# EAGLE design zb_pt4115_v1.2 (EAGLE 9.6.2)
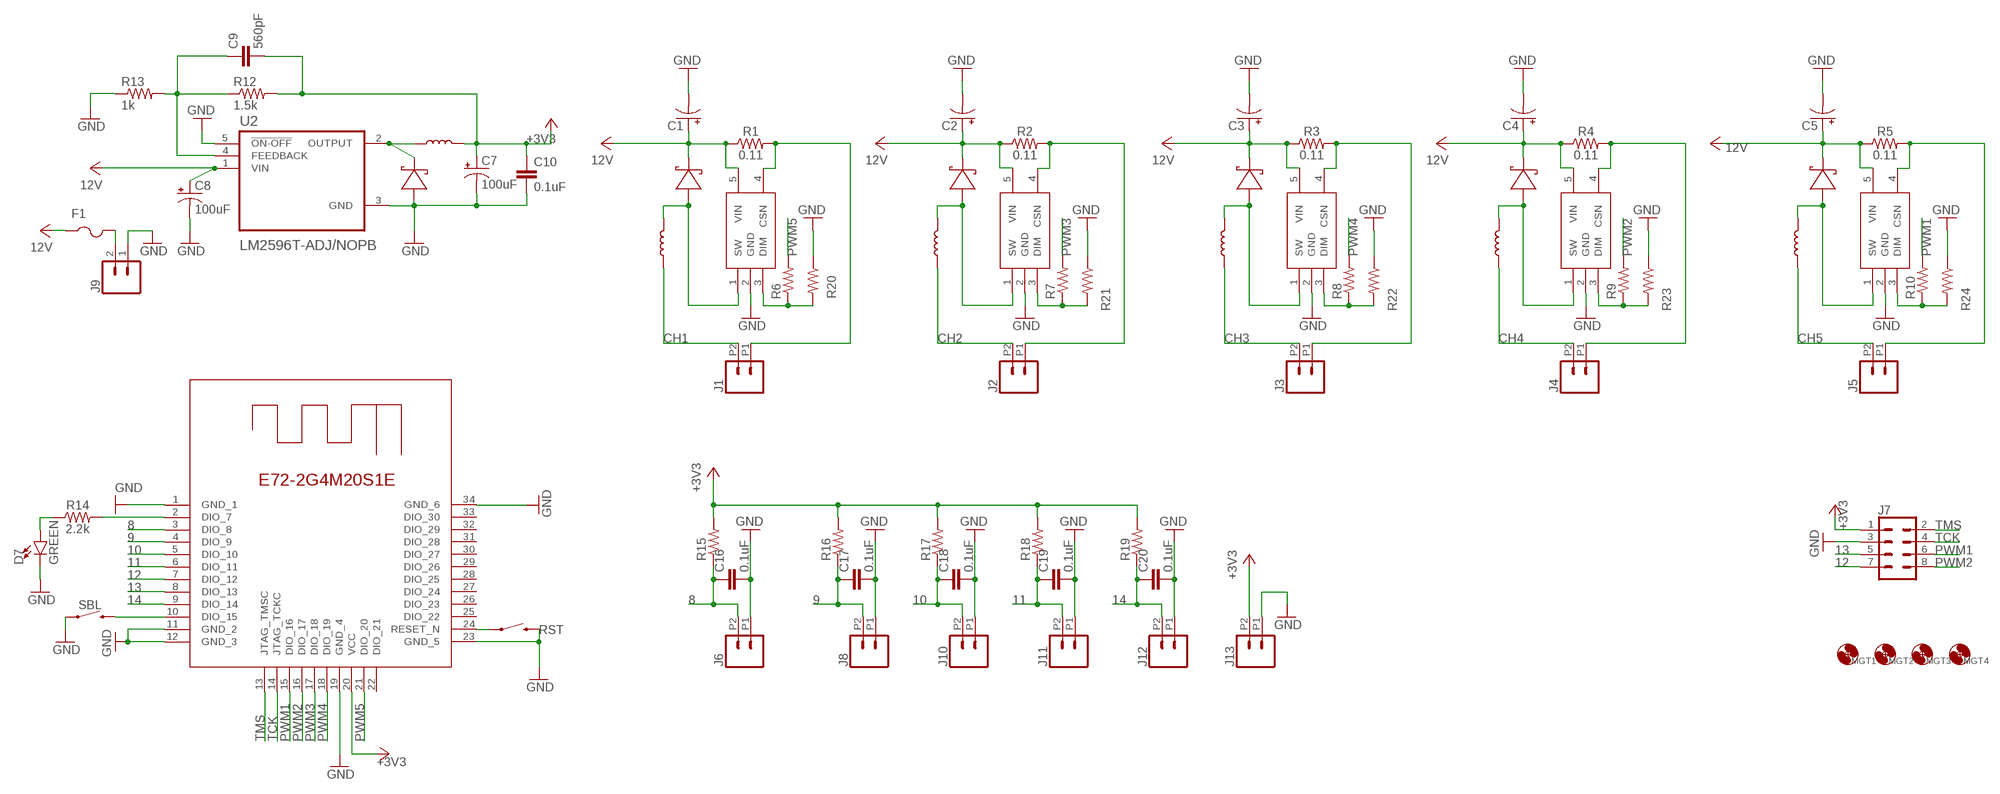
[diagram p0: schematic, sheet 1]

## Parts
C1  100uF  100UF-POLAR-EIA7343-16V-10%(TANT)  [EIA7343]
C2  100uF  100UF-POLAR-EIA7343-16V-10%(TANT)  [EIA7343]
C3  100uF  100UF-POLAR-EIA7343-16V-10%(TANT)  [EIA7343]
C4  100uF  100UF-POLAR-EIA7343-16V-10%(TANT)  [EIA7343]
C5  100uF  100UF-POLAR-EIA7343-16V-10%(TANT)  [EIA7343]
C7  100uF  100UF-POLAR-25V-20%(ELEC)  [PANASONIC_D]
C8  100uF  100UF-POLAR-25V-20%(ELEC)  [PANASONIC_D]
C9  560pF  560PF-0603-50V-5%  [0603]
C10  0.1uF  0.1UF-0603-25V-5%  [0603]
C16  0.1uF  0.1UF-0603-100V-10%  [0603]
C17  0.1uF  0.1UF-0603-100V-10%  [0603]
C18  0.1uF  0.1UF-0603-100V-10%  [0603]
C19  0.1uF  0.1UF-0603-100V-10%  [0603]
C20  0.1uF  0.1UF-0603-100V-10%  [0603]
D1  SS18  [DIOM5227X270N]
D2  SS18  [DIOM5227X270N]
D3  SS18  [DIOM5227X270N]
D4  SS18  [DIOM5227X270N]
D5  SS18  [DIOM5227X270N]
D6  SS18  [DIOM5227X270N]
D7  GREEN  LED-GREEN0603  [LED-0603]
F1  PTCFUSE-1812  [1812]
IC1  68uH  MSS1038-473MLB  [INDPM102100X400N]
IC2  68uH  MSS1038-473MLB  [INDPM102100X400N]
IC3  68uH  MSS1038-473MLB  [INDPM102100X400N]
IC4  68uH  MSS1038-473MLB  [INDPM102100X400N]
IC5  68uH  MSS1038-473MLB  [INDPM102100X400N]
IC6  68uH  MSS1038-473MLB  [INDPM102100X400N]
J1  CONN_022.54MM_SCREWTERM  [1X02_2.54_SCREWTERM]
J2  CONN_022.54MM_SCREWTERM  [1X02_2.54_SCREWTERM]
J3  CONN_022.54MM_SCREWTERM  [1X02_2.54_SCREWTERM]
J4  CONN_022.54MM_SCREWTERM  [1X02_2.54_SCREWTERM]
J5  CONN_022.54MM_SCREWTERM  [1X02_2.54_SCREWTERM]
J6  CONN_022.54MM_SCREWTERM  [1X02_2.54_SCREWTERM]
J7  CONN_04X2  [2X4]
J8  CONN_022.54MM_SCREWTERM  [1X02_2.54_SCREWTERM]
J9  CONN_025MM  [SCREWTERMINAL-5MM-2]
J10  CONN_022.54MM_SCREWTERM  [1X02_2.54_SCREWTERM]
J11  CONN_022.54MM_SCREWTERM  [1X02_2.54_SCREWTERM]
J12  CONN_022.54MM_SCREWTERM  [1X02_2.54_SCREWTERM]
J13  CONN_022.54MM_SCREWTERM  [1X02_2.54_SCREWTERM]
MGT1  MOUNT-HOLE3.0  [3,0]
MGT2  MOUNT-HOLE3.0  [3,0]
MGT3  MOUNT-HOLE3.0  [3,0]
MGT4  MOUNT-HOLE3.0  [3,0]
R1  0.11  0.11OHM-2010-1/2W-1%  [2010]
R2  0.11  0.11OHM-2010-1/2W-1%  [2010]
R3  0.11  0.11OHM-2010-1/2W-1%  [2010]
R4  0.11  0.11OHM-2010-1/2W-1%  [2010]
R5  0.11  0.11OHM-2010-1/2W-1%  [2010]
R6  100Ohm  R-US_R0805  [R0805]
R7  100Ohm  R-US_R0805  [R0805]
R8  100Ohm  R-US_R0805  [R0805]
R9  100Ohm  R-US_R0805  [R0805]
R10  100Ohm  R-US_R0805  [R0805]
R12  1.5k  R-US_R0805  [R0805]
R13  1k  R-US_R0805  [R0805]
R14  2.2k  2.2KOHM-0603-1/10W-1%  [0603]
R15  10k  R-US_R0805  [R0805]
R16  10k  R-US_R0805  [R0805]
R17  10k  R-US_R0805  [R0805]
R18  10k  R-US_R0805  [R0805]
R19  10k  R-US_R0805  [R0805]
R20  3k  R-US_R0805  [R0805]
R21  3k  R-US_R0805  [R0805]
R22  3k  R-US_R0805  [R0805]
R23  3k  R-US_R0805  [R0805]
R24  3k  R-US_R0805  [R0805]
RST  MOMENTARY-SWITCH-SPST-SMD-4.6X2.8MM  [TACTILE_SWITCH_SMD_4.6X2.8MM]
SBL  MOMENTARY-SWITCH-SPST-SMD-4.6X2.8MM  [TACTILE_SWITCH_SMD_4.6X2.8MM]
U2  LM2596T-ADJ/NOPB  [TO170P1016X470X2092-5]
U$1  PT4115  [SOT-89-5]
U$2  PT4115  [SOT-89-5]
U$3  PT4115  [SOT-89-5]
U$4  PT4115  [SOT-89-5]
U$5  PT4115  [SOT-89-5]
U$6  E72-2G4M20S1E  [E72-2G4M20S1E]

## Nets
8: C16.1 J6.P2 R15.1 U$6.3(DIO_8)
9: C17.1 J8.P2 R16.1 U$6.4(DIO_9)
10: C18.1 J10.P2 R17.1 U$6.5(DIO_10)
11: C19.1 J11.P2 R18.1 U$6.6(DIO_11)
12: J7.7 U$6.7(DIO_12)
13: J7.5 U$6.8(DIO_13)
14: C20.1 J12.P2 R19.1 U$6.9(DIO_14)
+3V3: C7.+ C9.2 C10.1 IC6.2 J7.1 J13.P2 R12.2 R15.2 R16.2 R17.2 R18.2 R19.2 U$6.20(VCC)
CH1: IC1.1 J1.P2
CH2: IC2.1 J2.P2
CH3: IC3.1 J3.P2
CH4: IC4.1 J4.P2
CH5: IC5.1 J5.P2
GND: C1.C(-) C2.C(-) C3.C(-) C4.C(-) C5.C(-) C7.- C8.- C10.2 C16.2 C17.2 C18.2 C19.2 C20.2 D6.2(A) D7.C J6.P1 J7.3 J8.P1 J9.1 J10.P1 J11.P1 J12.P1 J13.P1 R13.1 R20.1 R21.1 R22.1 R23.1 R24.1 RST.3 RST.4 SBL.1 SBL.2 U2.3(GND) U2.5(!ON-OFF) U$1.2(GND) U$2.2(GND) U$3.2(GND) U$4.2(GND) U$5.2(GND) U$6.1(GND_1) U$6.11(GND_2) U$6.12(GND_3) U$6.19(GND_4) U$6.23(GND_5) U$6.34(GND_6)
N$1: D1.2(A) IC1.2 U$1.1(SW)
N$2: R6.1 R20.2 U$1.3(DIM)
N$3: C9.1 R12.1 R13.2 U2.4(FEEDBACK)
N$4: D2.2(A) IC2.2 U$2.1(SW)
N$5: J1.P1 R1.2 U$1.4(CSN)
N$6: J2.P1 R2.2 U$2.4(CSN)
N$7: R7.1 R21.2 U$2.3(DIM)
N$8: R8.1 R22.2 U$3.3(DIM)
N$9: D3.2(A) IC3.2 U$3.1(SW)
N$10: J3.P1 R3.2 U$3.4(CSN)
N$11: R9.1 R23.2 U$4.3(DIM)
N$12: R10.1 R24.2 U$5.3(DIM)
N$13: D4.2(A) IC4.2 U$4.1(SW)
N$14: J4.P1 R4.2 U$4.4(CSN)
N$15: D7.A R14.1
N$16: D6.1(K) IC6.1 U2.2(OUTPUT)
N$17: D5.2(A) IC5.2 U$5.1(SW)
N$18: J5.P1 R5.2 U$5.4(CSN)
N$19: RST.1 RST.2 U$6.24(RESET_N)
N$20: R14.2 U$6.2(DIO_7)
N$28: SBL.3 SBL.4 U$6.10(DIO_15)
PWM1: J7.6 R10.2 U$6.15(DIO_16)
PWM2: J7.8 R9.2 U$6.16(DIO_17)
PWM3: R7.2 U$6.17(DIO_18)
PWM4: R8.2 U$6.18(DIO_19)
PWM5: R6.2 U$6.21(DIO_20)
TCK: J7.4 U$6.14(JTAG_TCKC)
TMS: J7.2 U$6.13(JTAG_TMSC)
VCC: C1.A(+) C2.A(+) C3.A(+) C4.A(+) C5.A(+) C8.+ D1.1(K) D2.1(K) D3.1(K) D4.1(K) D5.1(K) F1.1 F1.2 J9.2 R1.1 R2.1 R3.1 R4.1 R5.1 U2.1(VIN) U$1.5(VIN) U$2.5(VIN) U$3.5(VIN) U$4.5(VIN) U$5.5(VIN) ; supply symbol labelled 12V
Unconnected: U$6.22(DIO_21) U$6.25(DIO_22) U$6.26(DIO_23) U$6.27(DIO_24) U$6.28(DIO_25) U$6.29(DIO_26) U$6.30(DIO_27) U$6.31(DIO_28) U$6.32(DIO_29) U$6.33(DIO_30)

## Library data of the parts
C1-C5 = SparkFun-Capacitors:100UF-POLAR: 100µF polarized capacitors A capacitor is a passive two-terminal electrical component used to store electrical energy temporarily in an electric field.; PROD_ID: CAP-08702
C7 C8 = SparkFun-Capacitors:100UF-POLAR: 100µF polarized capacitors A capacitor is a passive two-terminal electrical component used to store electrical energy temporarily in an electric field.; PROD_ID: CAP-12547
C9 = SparkFun-Capacitors:560PF: 0.56nF/560pF ceramic capacitors A capacitor is a passive two-terminal electrical component used to store electrical energy temporarily in an electric field.; PROD_ID: CAP-08749
C10 = SparkFun-Capacitors:0.1UF: 0.1µF ceramic capacitors A capacitor is a passive two-terminal electrical component used to store electrical energy temporarily in an electric field.; PROD_ID: CAP-08604
C16-C20 = SparkFun-Capacitors:0.1UF: 0.1µF ceramic capacitors A capacitor is a passive two-terminal electrical component used to store electrical energy temporarily in an electric field.; PROD_ID: CAP-08390
D1-D6 = SS18:SS18: Schottky Diodes & Rectifiers 1a 80V Rectifier Schottky Barrier Source: Datasheet <https://componentsearchengine.com/Datasheets/2/SS18.pdf>; ARROW_PART_NUMBER: SS18; ARROW_PRICE-STOCK: https://www.arrow.com/en/products/ss18/on-semiconductor?region=nac; DESCRIPTION: Schottky Diodes & Rectifiers 1a 80V Rectifier Schottky Barrier; HEIGHT: 2.7mm; MANUFACTURER_NAME: ON Semiconductor; MANUFACTURER_PART_NUMBER: SS18; MOUSER_PART_NUMBER: 512-SS18; MOUSER_PRICE-STOCK: https://www.mouser.co.uk/ProductDetail/ON-Semiconductor-Fairchild/SS18?qs=mVVXn4M53U%252B25aMJheuSLA%3D%3D
D7 = SparkFun-LED:LED-GREEN: Green SMD LED Used in manufacturing of various products at SparkFun Packages: 0603 - SMD 0603 package [Product Link] <http://www.futureelectronics.com/en/technologies/semiconductors/optoelectronics/leds/Pages/9894312-LTST-C190GKT.aspx?CrossPart=HSMG-C190&IM=0> LilyPad 1206 - SMD1206 LilyPad package [Product Link] <http://www.futureelectronics.com/en/Technologies/Product.aspx?ProductID=IN150NGHARVATEKCORPORATION2049943&IM=0> 1206 - SMD1206 package [Product Link] <http://www.futureelectronics.com/en/technologies/semiconductors/optoelectronics/leds/Pages/8315665-LTST-C150KGKT.aspx?IM=0> 1206 Bottom Mount -SMD 1206 Bottom Mount [Product Link] <http://www.digikey.com/product-detail/en/lite-on-inc/LTST-C230KGKT/160-1456-1-ND/386854> SparkFun Products: Pro Mini 328 -5V <https://www.sparkfun.com/products/821> RedBoard <https://www.sparkfun.com/products/12757> MP3 Trigger <https://www.sparkfun.com/products/13720> Makey Makey <https://www.sparkfun.com/products/11076>; PROD_ID: DIO-00821
F1 = adafruit:PTCFUSE: PTC fuses, resettable thermistors
IC1-IC6 = MSS1038-473MLB:MSS1038-473MLB: Fixed Inductors MSS1038 SMT Shielded 47 uH 20 % 2.2 A Source: Datasheet <https://componentsearchengine.com/Datasheets/1/MSS1038-473MLB.pdf>; DESCRIPTION: Fixed Inductors MSS1038 SMT Shielded 47 uH 20 % 2.2 A; HEIGHT: 4mm; MANUFACTURER_NAME: COILCRAFT; MANUFACTURER_PART_NUMBER: MSS1038-473MLB; MOUSER_PART_NUMBER: 994-MSS1038-473MLB; MOUSER_PRICE-STOCK: https://www.mouser.co.uk/ProductDetail/Coilcraft/MSS1038-473MLB/?qs=VJjuEbE9QBN6EsaT8NREzg%3D%3D
J1-J6 J8 J10-J13 = SparkFun-Connectors:CONN_02: Multi connection point. Often used as Generic Header-pin footprint for 0.1 inch spaced/style header connections On any of the 0.1 inch spaced packages, you can populate with these: Break Away Headers - Straight <https://www.sparkfun.com/products/116> (PRT-00116) Break Away Male Headers - Right Angle <https://www.sparkfun.com/products/553> (PRT-00553) Female Headers <https://www.sparkfun.com/products/115> (PRT-00115) Break Away Headers - Machine Pin <https://www.sparkfun.com/products/117> (PRT-00117) Break Away Female Headers - Swiss Machine Pin <https://www.sparkfun.com/products/743> (PRT-00743) For SCREWTERMINALS and SPRING TERMINALS visit here: Screw Terimnals on SparkFun.com <https://www.sparkfun.com/search/results?term=Screw+Terminals> (5mm/3.5mm/2.54mm spacing) This device is also useful as a general connection point to wire up your design to another part of your project. Our various solder wires solder well into these plated through hole pads. Hook-Up Wire - Assortment (Stranded, 22 AWG) <https://www.sparkfun.com/products/11375> (PRT-11375) Hook-Up Wire - Assortment (Solid Core, 22 AWG) <https://www.sparkfun.com/products/11367> (PRT-11367) View the entire wire category on our website here <https://www.sparkfun.com/categories/141> Special notes: Molex polarized connector foot print use with: PRT-08233 with associated crimp pins and housings. 2.54_SCREWTERM for use with PRT-10571. 3.5mm Screw Terminal footprints for PRT-08084 5mm Screw Terminal footprints for use with PRT-08432
J7 = SparkFun-SEWPAD16:CONN_04X2: Multi connection point. Often used as Generic Header-pin footprint for 0.1 inch spaced/style header connections On any of the 0.1 inch spaced packages, you can populate with these: Break Away Headers - Straight <https://www.sparkfun.com/products/116> (PRT-00116) Break Away Male Headers - Right Angle <https://www.sparkfun.com/products/553> (PRT-00553) Female Headers <https://www.sparkfun.com/products/115> (PRT-00115) Break Away Headers - Machine Pin <https://www.sparkfun.com/products/117> (PRT-00117) Break Away Female Headers - Swiss Machine Pin <https://www.sparkfun.com/products/743> (PRT-00743)
J9 = SparkFun-SEWPAD16:CONN_02: Multi connection point. Often used as Generic Header-pin footprint for 0.1 inch spaced/style header connections On any of the 0.1 inch spaced packages, you can populate with these: Break Away Headers - Straight <https://www.sparkfun.com/products/116> (PRT-00116) Break Away Male Headers - Right Angle <https://www.sparkfun.com/products/553> (PRT-00553) Female Headers <https://www.sparkfun.com/products/115> (PRT-00115) Break Away Headers - Machine Pin <https://www.sparkfun.com/products/117> (PRT-00117) Break Away Female Headers - Swiss Machine Pin <https://www.sparkfun.com/products/743> (PRT-00743) For SCREWTERMINALS and SPRING TERMINALS visit here: Screw Terimnals on SparkFun.com <https://www.sparkfun.com/search/results?term=Screw+Terminals> (5mm/3.5mm/2.54mm spacing) This device is also useful as a general connection point to wire up your design to another part of your project. Our various solder wires solder well into these plated through hole pads. Hook-Up Wire - Assortment (Stranded, 22 AWG) <https://www.sparkfun.com/products/11375> (PRT-11375) Hook-Up Wire - Assortment (Solid Core, 22 AWG) <https://www.sparkfun.com/products/11367> (PRT-11367) View the entire wire category on our website here <https://www.sparkfun.com/categories/141> Special notes: Molex polarized connector foot print use with: PRT-08233 with associated crimp pins and housings. 2.54_SCREWTERM for use with PRT-10571. 3.5mm Screw Terminal footprints for PRT-08084 5mm Screw Terminal footprints for use with PRT-08432; SF_SKU: PRT-08432
MGT1-MGT4 = holes:MOUNT-HOLE: MOUNTING HOLE with drill center marker
R1-R5 = SparkFun-Resistors:0.11OHM: 0.11Ω resistor A resistor is a passive two-terminal electrical component that implements electrical resistance as a circuit element. Resistors act to reduce current flow, and, at the same time, act to lower voltage levels within circuits. - Wikipedia; PROD_ID: RES-08354
R6-R10 R12 R13 R15-R24 = adafruit:R-US_: RESISTOR, American symbol
R14 = SparkFun-Resistors:2.2KOHM: 2.2kΩ resistor A resistor is a passive two-terminal electrical component that implements electrical resistance as a circuit element. Resistors act to reduce current flow, and, at the same time, act to lower voltage levels within circuits. - Wikipedia; PROD_ID: RES-08272
RST SBL = SparkFun-Switches:MOMENTARY-SWITCH-SPST: Momentary Switch (Pushbutton) - SPST Normally-open (NO) SPST momentary switches (buttons, pushbuttons). Variants PTH-12MM - 12mm square, through-hole Momentary Pushbutton Switch - 12mm Square <https://www.sparkfun.com/products/9190> (COM-09190) PTH-6.0MM, PTH-6.0MM-KIT - 6.0mm square, through-hole Mini Pushbutton Switch <https://www.sparkfun.com/products/97> (COM-00097) KIT package intended for soldering kit's - only one side of pads' copper is exposed. PTH-RIGHT-ANGLE-KIT - Right-angle, through-hole Right Angle Tactile Button <https://www.sparkfun.com/products/10791> - Used on SparkFun BigTime Watch Kit <https://www.sparkfun.com/products/11734> SMD-12MM - 12mm square, surface-mount Tactile Button - SMD (12mm) <https://www.sparkfun.com/products/12993> (COM-12993) Used on SparkFun PicoBoard <https://www.sparkfun.com/products/11888> SMD-4.5MM - 4.5mm Square Trackball Switch Used on SparkFun Blackberry Trackballer Breakout <https://www.sparkfun.com/products/13169> SMD-4.6MMX2.8MM - 4.60mm x 2.80mm, surface mount Used on SparkFun SAMD21 Mini Breakout <https://www.sparkfun.com/products/13664> SMD-5.2MM, SMD-5.2-REDUNDANT - 5.2mm square, surface-mount Mini Pushbutton Switch - SMD <https://www.sparkfun.com/products/8720> (COM-08720) Used on Arduino Pro Mini <https://www.sparkfun.com/products/11114> REDUNDANT package connects both switch circuits together SMD-6.0X3.5MM - 6.0 x 3.5mm, surface mount Momentary Reset Switch SMD <https://www.sparkfun.com/products/8229> (COM-08229) SMD-6.2MM-TALL - 6.2mm square, surface mount Tactile Button - SMD (6mm) <https://www.sparkfun.com/products/12992> Used on SparkFun Digital Sandbox <https://www.sparkfun.com/products/12651> SMD-RIGHT-ANGLE - Right-angle, surface mount Used on SparkFun Block for Intel® Edison - Arduino <https://www.sparkfun.com/products/13036>; PROD_ID: SWCH-13065
U2 = LM2596T-ADJ_NOPB:LM2596T-ADJ/NOPB: Check prices <https://pricing.snapeda.com/parts/LM2596T-ADJ/NOPB/Texas%20Instruments/view-part?ref=eda>; AVAILABILITY: In Stock; DESCRIPTION: SIMPLE SWITCHER&reg; 4.5V to 40V, 3A Low Component Count Step-Down Regulator 5-TO-220 -40 to 125; MF: Texas Instruments; MP: LM2596T-ADJ/NOPB; PACKAGE: TO-220-5 Texas Instruments; PRICE: None; PURCHASE-URL: https://pricing.snapeda.com/search/part/LM2596T-ADJ/NOPB/?ref=eda
U$1-U$5 = PT4115:PT4115: 30V, 1.2A Step-down HIgh Brightness LED Driver with 5000:1 Dimming Check prices <https://pricing.snapeda.com/parts/PT4115/Pulse/view-part?ref=eda>; AVAILABILITY: Not in stock; MF: Pulse; MP: PT4115; PACKAGE: None; PRICE: None
U$6 = E72-2G4M20S1E:E72-2G4M20S1E

## Board
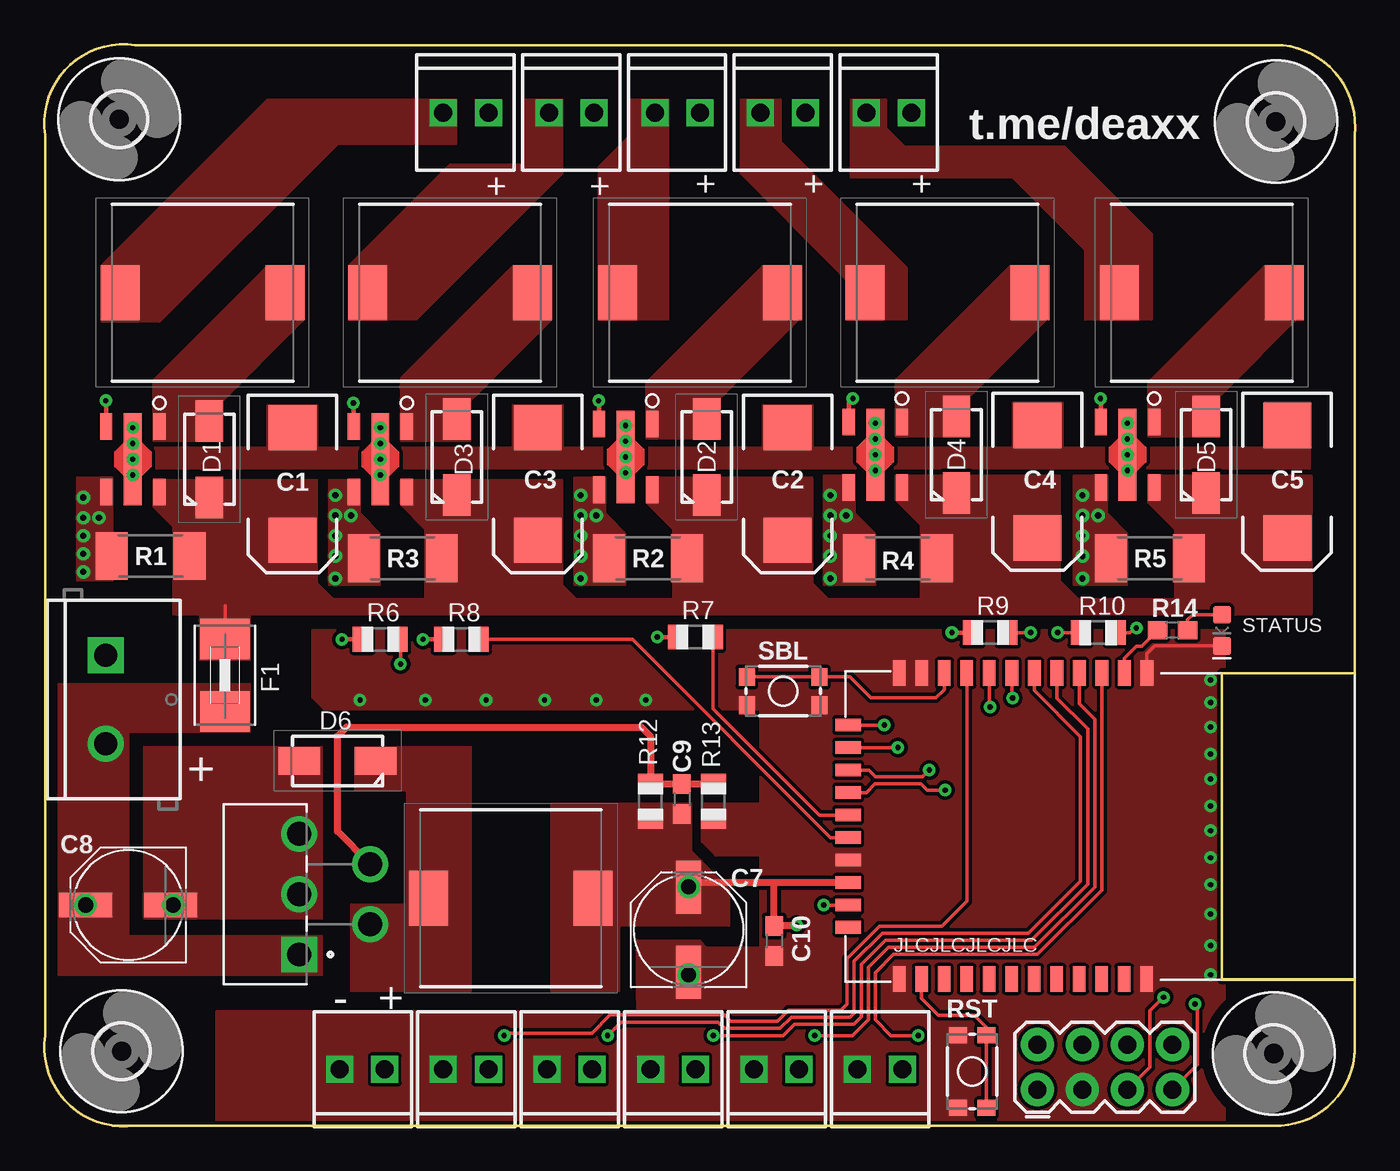
[diagram p1: board, top side]
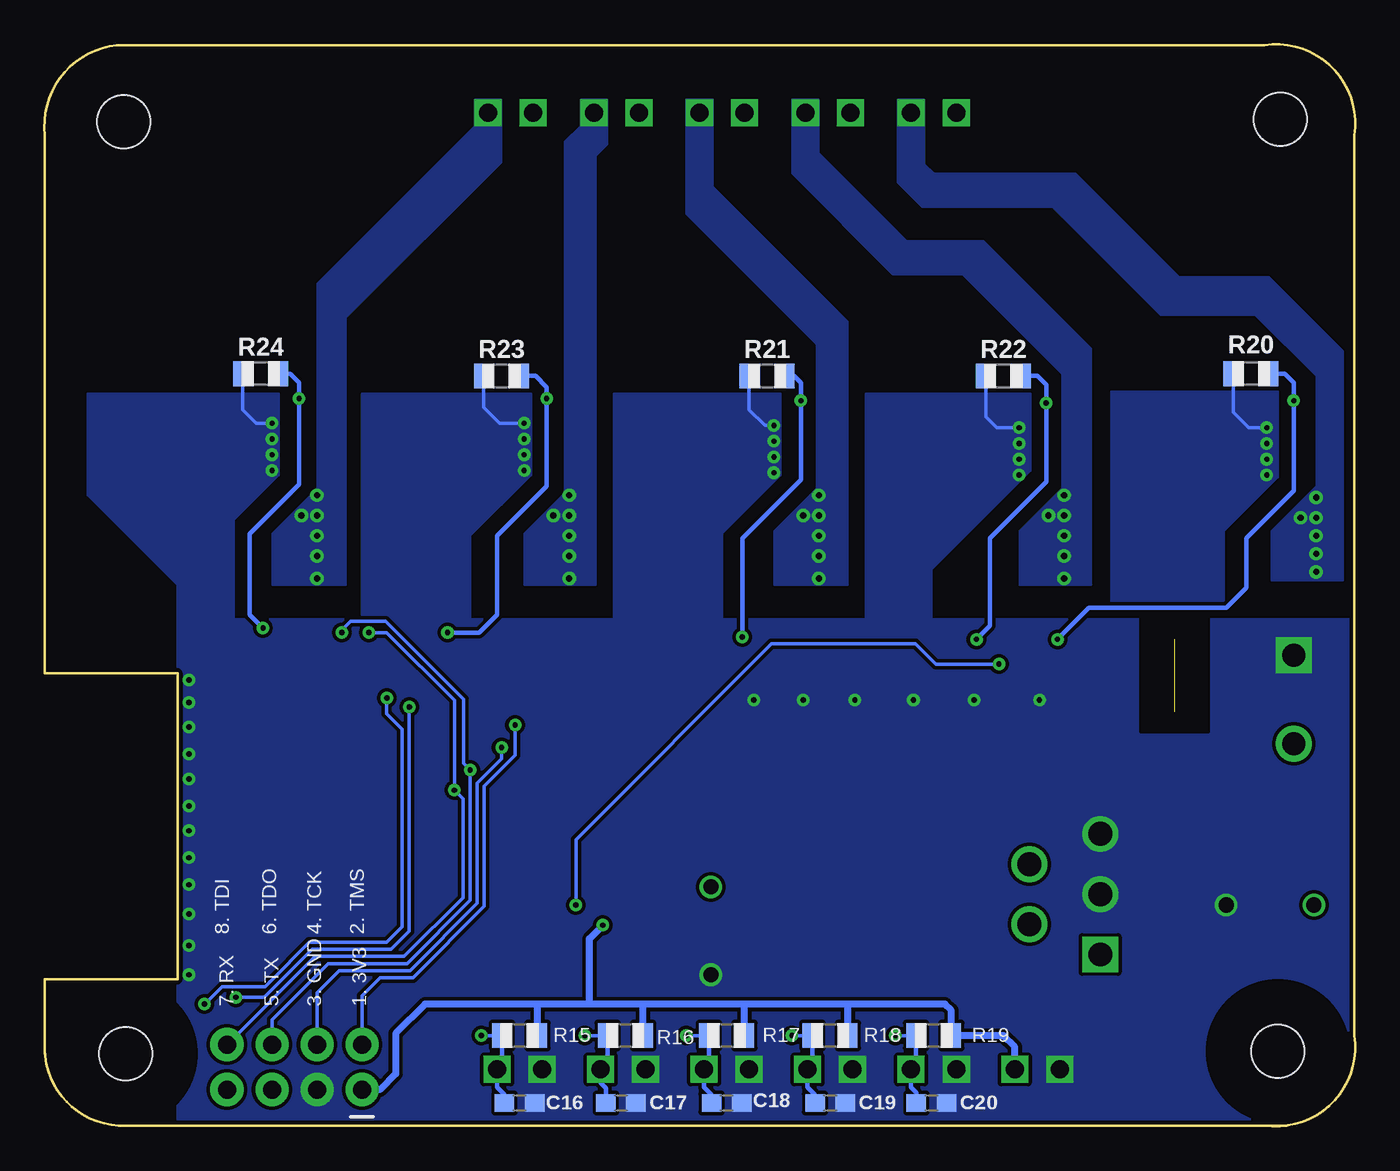
[diagram p2: board, bottom side, seen from below]

Size 73.98 x 61.04 mm. Coordinates in mm from the lower left corner, seen from the top.
Outline: 5.12,0.04 3.85,0.04
Outline: 5.12,0.04 arc-106 0.04,5.12 0.04,55.92 arc-106 5.12,61 69.89,61 arc-90 73.95,55.92 73.95,25.57 66.46,25.57 66.46,8.3 73.95,8.3 73.95,4.36
Outline: 5.12,0.04 69.38,0.04
Outline: 69.38,0.04 69.76,0.04
Outline: 73.95,4.36 73.95,4.1
Outline: 73.95,4.36 arc-92 69.38,0.04
Copper layers (1*16): Top 0.035mm / dielectric 1.5mm / Bottom 0.035mm
Design rules "default *": minimum track width 0.2mm, minimum drill 0.3mm, track to track 0.2mm, track to pad 6mil, pad to pad 6mil, via to via 6mil, smd to smd 6mil, copper to edge 0.2mm, drill to drill 0.3mm, minimum pad ring 10mil, minimum via ring 8mil, stop-mask expansion 2mil, vias tented up to drill 0.35mm, thermal gap 10mil
bRestrict: area 8.3,22.3 to 12.1,28.6

### Footprints (pad centres in the part's own frame; a part is rotated, then mirrored left to right if it is on the bottom)
EIA7343 = smd 2.55 x 2.7: A 3.17,0; C -3.17,0
PANASONIC_D = smd 3 x 1.4: + 2.4,0; - -2.4,0
0603 = smd 1.1 x 1: 1 -0.85,0; 2 0.85,0
DIOM5227X270N = smd 2.35 x 1.55: 1 -2.15,0; 2 2.15,0
LED-0603 = smd 1 x 1: A -0.877,0; C 0.877,0
1812 = smd 2.286 x 2.794: 1 -2.046,0; 2 2.046,0
INDPM102100X400N = smd 2.2 x 3.1: 1 -4.65,0; 2 4.65,0
1X02_2.54_SCREWTERM = drill 1.016 square: P1 2.54,0; P2 0,0
2X4 = drill 1.016 pad 1.88: 1 -3.81,-1.27; 2 -3.81,1.27; 3 -1.27,-1.27; 4 -1.27,1.27; 5 1.27,-1.27; 6 1.27,1.27; 7 3.81,-1.27; 8 3.81,1.27
SCREWTERMINAL-5MM-2 = drill 1.3 pad 2.032 square: 1 0,0 | drill 1.3 pad 2.032: 2 5,0
3,0 = hole 3: 0,0
2010 = smd 1.8 x 2.7: 1 -2.2,0; 2 2.2,0
R0805 = smd 1.1 x 1.4: 1 -1,0; 2 1,0
TACTILE_SWITCH_SMD_4.6X2.8MM = smd 0.9 x 1: 1 -2.05,-0.8; 2 2.05,-0.8; 3 2.05,0.8; 4 -2.05,0.8
TO170P1016X470X2092-5 = drill 1.35 square: 1 0,0 | drill 1.35: 2 1.7,-4; 3 3.4,0; 4 5.1,-4; 5 6.8,0
SOT-89-5 = smd 0.7 x 1.5: 1 -1.5,-1.85; 3 1.5,-1.85; 4 1.5,1.85; 5 -1.5,1.85 | smd 1 x 5.2: 2 0,0
E72-2G4M20S1E = smd 0.711 x 1.422: 1 17.098,17.411; 2 15.828,17.411; 3 14.558,17.411; 4 13.288,17.411; 5 12.018,17.411; 6 10.748,17.411; 7 9.478,17.411; 8 8.208,17.411; 9 6.938,17.411; 10 5.668,17.411; 11 4.398,17.411; 12 3.128,17.411; 23 3.115,0.143; 24 4.385,0.143; 25 5.655,0.143; 26 6.925,0.143; 27 8.195,0.143; 28 9.465,0.143; 29 10.735,0.143; 30 12.005,0.143; 31 13.275,0.143; 32 14.545,0.143; 33 15.815,0.143; 34 17.085,0.143 | smd 1.422 x 0.711: 13 0.246,14.471; 14 0.246,13.201; 15 0.246,11.931; 16 0.246,10.661; 17 0.246,9.391; 18 0.246,8.121; 19 0.246,6.851; 20 0.246,5.581; 21 0.246,4.311; 22 0.244,3.064

### Placement (x,y rotation side)
C1  14.01,36.24 270 top
C2  41.95,36.24 270 top
C3  27.85,36.24 270 top
C4  56.05,36.36 270 top
C5  70.14,36.36 270 top
C7  36.36,11.09 90 top
C8  4.74,12.49 180 top
C9  35.98,18.46 270 top
C10  41.19,10.45 270 top
C16  47.16,1.31 0 bottom
C17  41.44,1.31 0 bottom
C18  35.47,1.31 0 bottom
C19  29.63,1.31 0 bottom
C20  23.92,1.31 0 bottom
D1  9.31,37.63 90 top
D2  37.38,37.76 90 top
D3  23.28,37.76 90 top
D4  51.48,37.89 90 top
D5  65.57,37.89 90 top
D6  16.55,20.61 180 top
D7  66.46,27.98 270 top
F1  10.2,25.44 270 top
IC1  8.93,47.03 0 top
IC2  37,47.03 0 top
IC3  22.9,47.03 0 top
IC4  50.97,47.03 0 top
IC5  65.32,47.03 0 top
IC6  26.33,12.87 0 top
J1  22.52,57.19 0 top
J2  34.46,57.19 0 top
J3  28.49,57.19 0 top
J4  40.43,57.19 0 top
J5  46.4,57.19 0 top
J6  48.43,3.22 180 top
J7  59.86,3.34 0 top
J8  42.59,3.22 180 top
J9  3.47,26.58 270 top
J10  36.74,3.22 180 top
J11  30.9,3.22 180 top
J12  25.06,3.22 180 top
J13  19.22,3.22 180 top
MGT1  4.36,4.23 0 top
MGT2  69.38,4.1 0 top
MGT3  4.23,56.81 0 top
MGT4  69.51,56.68 0 top
R1  6.01,32.17 180 top
R2  34.08,32.04 180 top
R3  20.23,32.04 180 top
R4  48.17,32.04 180 top
R5  62.4,32.04 180 top
R6  18.96,27.47 0 top
R7  36.74,27.6 0 top
R8  23.54,27.47 0 top
R9  53.38,27.85 0 top
R10  59.48,27.85 180 top
R12  34.2,18.33 270 top
R13  37.76,18.33 90 top
R14  63.67,27.98 180 top
R15  47.16,5.12 0 bottom
R16  41.19,5.12 0 bottom
R17  35.47,5.12 0 bottom
R18  29.63,5.12 0 bottom
R19  23.79,5.12 0 bottom
R20  5.88,42.46 0 bottom
R21  33.19,42.33 0 bottom
R22  19.85,42.33 0 bottom
R23  48.17,42.33 0 bottom
R24  61.76,42.46 0 bottom
RST  52.36,3.09 90 top
SBL  41.7,24.55 0 top
U2  14.39,9.69 90 top
U$1  4.99,37.63 180 top
U$2  32.81,37.76 180 top
U$3  18.96,37.63 180 top
U$4  46.9,37.89 180 top
U$5  61.13,37.89 180 top
U$6  45.13,8.17 0 top

### Tracks (layer width: path | path; a pad name or v marks a point on that pad's centre or on a via)
8  (via drill 0.3)
  Top 0.2: v49.32,5.12 47.79,5.12 46.9,6.01 46.9,8.68 47.92,9.69 56.05,9.69 59.68,13.33 U$6.3
  Bottom 0.2: R15.1 v49.32,5.12
  Bottom 0.254: C16.1 48.01,1.78 48.43,2.2 J6.P2 48.43,3.72 48.16,3.99 R15.1
9  (via drill 0.3)
  Top 0.2: v43.47,5.12 45.61,5.12 46.5,6.01 46.5,8.97 47.63,10.09 55.88,10.09 59.28,13.49 59.28,22.97 58.41,23.84 U$6.4
  Bottom 0.2: R16.1 v43.47,5.12
  Bottom 0.254: C17.1 42.29,2.16 42.59,2.45 J8.P2 42.19,3.61 R16.1
10  (via drill 0.3)
  Top 0.2: v37.76,5.12 41.7,5.12 42.33,5.76 45.68,5.76 46.1,6.18 46.1,9.13 47.46,10.49 55.72,10.49 58.88,13.66 58.88,22.42 57.14,24.16 U$6.5
  Bottom 0.2: R17.1 v37.76,5.12
  Bottom 0.254: C18.1 36.32,1.78 36.74,2.2 J10.P2 36.47,3.49 R17.1
11  (via drill 0.3)
  Top 0.2: v31.79,5.12 32.55,5.88 38.01,5.88 38.38,5.52 41.53,5.52 42.17,6.16 45.47,6.16 45.7,6.39 45.7,9.3 47.3,10.89 55.55,10.89 58.48,13.83 58.48,21.99 55.87,24.6 U$6.6
  Bottom 0.2: R18.1 v31.79,5.12
  Bottom 0.254: C19.1 30.48,1.78 30.9,2.2 J11.P2 30.63,3.49 R18.1
12  (via drill 0.3)
  Top 0.2: J7.7 65.06,3.47 65.06,6.77 v64.94,6.9 | U$6.7 54.6,24.22 v54.65,24.17
  Bottom 0.2: v54.65,24.17 54.65,23.28 53.78,22.41 53.78,11.25 54.65,10.38 59.03,10.38 61.24,8.17 | 61.25,8.17 61.24,8.17 | v64.94,6.9 63.95,7.89 61.53,7.89 61.24,8.17
13  (via drill 0.3)
  Top 0.2: J7.5 62.4,3.34 62.4,6.52 v63.16,7.28 | U$6.8 53.33,23.71 v53.38,23.66
  Bottom 0.2: v53.38,23.66 53.38,11 54.4,9.98 58.86,9.98 61.57,7.28 v63.16,7.28
14  (via drill 0.3)
  Top 0.2: v25.95,5.12 26.08,5.25 30.9,5.25 31.94,6.28 38.38,6.28 38.74,5.92 41.37,5.92 42,6.56 44.96,6.56 45.3,6.9 45.3,9.47 47.13,11.29 50.66,11.29 52.06,12.69 U$6.9
  Bottom 0.2: R19.1 v25.95,5.12
  Bottom 0.254: R19.1 24.79,3.49 J12.P2 25.06,2.2 24.77,1.91 C20.1
+3V3  (via drill 0.3, 0.85)
  Top 0.406: v42.46,11.34 41.23,11.34 C10.1 41.19,13.62 41.32,13.75 | U$6.20 41.32,13.75 | 41.32,13.75 36.62,13.75 36.5,13.62
  Top 0.508: C7.+ 36.5,13.62 36.62,13.74 | U$6.20 | C10.1 41.18,11.32
  Bottom 0.406: J13.P2 19.22,4.49 19.85,5.12 R19.2 22.79,6.53 23.15,6.9 28.62,6.9 | 28.62,6.9 34.46,6.9 | 34.46,6.9 40.3,6.9 | 40.3,6.9 43.22,6.9 | 43.22,6.9 46.14,6.9 | R18.2 28.63,6.88 28.62,6.9 | R17.2 34.47,6.88 34.46,6.9 | R16.2 40.19,6.79 40.3,6.9 | 46.14,6.9 52.49,6.9 54.14,5.25 54.14,2.96 55.03,2.07 J7.1 | R15.2 46.16,6.88 46.14,6.9 | 43.22,6.9 43.22,10.58 v42.46,11.34
  other vias: 36.36,13.5
  pour Top (no thermals): 32.43,7.66 28.62,7.66 28.62,18.2 36.49,18.2 36.49,15.53 38.65,13.38 38.65,11.34 32.43,11.34
CH1
  pour Top (no thermals): 6.52,45.38 3.22,45.38 3.22,48.55 12.61,57.95 23.28,57.95 23.28,55.41 16.55,55.41
CH2
  pour Top (no thermals): 35.22,45.51 31.28,45.51 31.28,54.14 32.93,55.79 32.93,57.95 35.22,57.95
CH3
  pour Top (no thermals): 21,45.51 17.19,45.51 17.19,48.55 22.9,54.27 27.09,54.27 27.09,57.95 29.25,57.95 29.25,53.76
CH4
  pour Top (no thermals): 48.68,45.51 45.25,45.51 45.25,47.79 39.28,53.76 39.28,57.95 41.57,57.95 41.57,55.54 48.68,48.43
CH5
  pour Top (no thermals): 62.52,45.51 58.71,45.51 58.71,49.44 54.65,53.51 45.51,53.51 45.51,57.95 47.54,57.95 47.54,56.3 48.55,55.29 57.57,55.29 62.52,50.33
GND  (via drill 0.3, 0.85)
  Top 0.2: U$6.1 62.22,26.66 62.66,27.1 D7.C
  Bottom 0.2: v4.99,39.41 6.01,39.41 6.88,40.28 R20.1 | v18.96,39.41 20.23,39.41 20.85,40.03 R22.1 | v32.81,39.54 33.31,39.54 34.2,40.43 34.2,42.32 R21.1 | v46.9,39.66 48.3,39.66 49.19,40.55 49.19,42.32 R23.1 | v61.13,39.66 62.02,39.66 62.78,40.43 62.78,42.44 R24.1
  other vias: 4.99,37.63 4.99,38.52 4.99,36.74 18.96,37.63 18.96,38.52 18.96,36.74 32.81,37.76 32.81,38.65 32.81,36.87 46.9,37.89 46.9,38.78 46.9,37 61.13,37.89 61.13,38.78 61.13,37 33.95,24.04 31.16,24.04 28.23,24.04 24.93,24.04 21.5,24.04 17.82,24.04 7.28,12.49 36.36,8.55 65.83,25.19 65.83,23.92 65.83,22.52 65.83,21 65.83,19.6 65.83,18.07 65.83,16.68 65.83,15.15 65.83,13.63 65.83,11.98 65.83,10.2 65.83,8.55
  pour Top (no thermals): 3.98,38.27 3.98,37.12 71.41,37.12 71.41,40.81 68.87,40.81 68.87,38.27 57.44,38.27 57.44,40.81 54.65,40.81 54.65,38.27 43.35,38.27 43.35,40.68 40.55,40.68 40.55,38.27 29.25,38.27 29.25,40.68 26.46,40.68 26.46,38.27 15.41,38.27 15.41,40.68 12.61,40.68 12.61,38.27
  pour Top (no thermals): 5.63,11.72 15.66,11.72 15.66,21.38 5.63,21.38
  pour Bottom (no thermals): -0.59,28.62 66.46,28.62 66.46,-0.34 -0.59,-0.34
  pour Top (no thermals): 33.44,10.45 33.44,7.15 43.98,7.15 43.98,10.07 37.38,10.07 37,10.45
  pour Top (no thermals): 37.12,18.2 37.12,16.04 37.89,15.28 40.68,15.28 40.68,18.2
  pour Bottom (no thermals): 18.33,41.32 18.33,37 23.92,31.41 23.92,28.11 27.6,28.11 27.6,41.32
  pour Bottom (no thermals): 32.43,41.32 32.43,36.74 35.73,33.44 35.73,28.11 41.82,28.11 41.82,41.32
  pour Bottom (no thermals): 46.52,41.32 46.52,36.74 49.95,33.31 49.95,28.36 56.05,28.36 56.05,41.32
  pour Bottom (no thermals): 60.75,41.32 60.75,36.74 63.29,34.2 63.29,28.23 66.46,28.23 66.46,30.52 71.54,35.6 71.54,41.32
  pour Top (no thermals): 15.15,27.98 15.15,24.17 15.79,23.54 40.43,23.54 40.43,-0.21 66.59,-0.21 66.59,27.98
  pour Top (no thermals): 41.32,0.29 9.69,0.29 9.69,6.52 33.44,6.52 33.44,8.3 41.32,8.3
  pour Bottom (no thermals): 4.36,41.44 13.76,41.44 13.76,28.23 8.42,28.23 7.41,29.25 7.41,33.57 4.36,36.62
N$1
  pour Top (no thermals): 10.07,38.65 6.14,38.65 6.14,42.08 12.61,48.55 14.65,48.55 14.65,45.51 10.07,40.93
N$2  (via drill 0.3)
  Top 0.254: R6.1 v16.8,27.47 | U$1.3 3.49,40.91 v3.47,40.93
  Bottom 0.254: R20.2 3.98,42.46 3.47,41.95 v3.47,40.93 3.47,35.85 6.14,33.19 6.14,30.39 7.28,29.25 15.03,29.25 v16.8,27.47
N$3
  Top 0.406: U2.4 16.55,16.63 16.55,22.01 17.06,22.52 33.7,22.52 34.2,22.01 R12.1 35.96,19.33 C9.1 36,19.33 R13.2
N$4
  pour Top (no thermals): 38.14,38.78 33.95,38.78 33.95,41.95 40.55,48.55 42.71,48.55 42.71,45.63 38.14,41.06
N$5  (via drill 0.35)
  other vias: 2.2,31.28 2.2,32.3 2.2,33.31 2.2,34.33 2.2,35.47 3.09,34.33
  pour Top (no thermals): 3.85,30.77 1.82,30.77 1.82,36.62 3.85,36.62
  pour Bottom (no thermals): 24.3,57.95 24.3,54.27 23.79,53.76 15.79,53.76 9.95,47.92 4.87,47.92 0.68,43.73 0.68,30.77 4.74,30.77 4.74,33.57 2.2,36.11 2.2,42.33 5.63,45.76 10.96,45.76 17.06,51.86 24.42,51.86 25.82,53.25 25.82,57.95
N$6  (via drill 0.35)
  other vias: 30.27,30.9 30.27,33.31 30.27,32.17 30.27,34.46 30.27,35.6 31.16,34.46
  pour Top (no thermals): 32.81,30.52 29.89,30.52 29.89,36.62 31.66,36.62 31.66,34.58 32.81,33.44
  pour Bottom (no thermals): 32.81,30.52 28.62,30.52 28.62,45.38 36.24,53 36.24,57.95 37.76,57.95 37.76,51.48 30.39,44.11 30.39,35.98 32.81,33.57
  pour Bottom: 28.62,45.38 28.62,30.52 32.81,30.52 32.81,33.57 30.39,35.98 30.39,44.11 37.76,51.48 37.76,57.95 36.24,57.95 36.24,53
N$7  (via drill 0.3)
  Top 0.254: R7.1 v34.58,27.6 | U$2.3 31.31,40.91 v31.28,40.93
  Bottom 0.254: v34.58,27.6 34.58,33.19 31.28,36.49 v31.28,40.93 31.28,41.95 31.66,42.33 R21.2
N$8  (via drill 0.3)
  Top 0.254: R8.1 v21.38,27.47 | U$3.3 17.46,40.78 v17.44,40.81
  Bottom 0.254: v21.38,27.47 20.61,28.23 20.61,33.19 17.44,36.36 v17.44,40.81 17.44,41.82 17.95,42.33 R22.2
N$9
  pour Top (no thermals): 24.04,38.65 20.11,38.65 20.11,42.2 26.46,48.55 28.62,48.55 28.62,45.51 24.04,40.93
N$10  (via drill 0.35)
  other vias: 16.42,30.9 16.42,33.31 16.42,32.17 16.42,34.46 16.42,35.6 17.31,34.46
  pour Top (no thermals): 18.96,30.52 16.04,30.52 16.04,36.49 17.82,36.49 17.82,34.58 18.96,33.44
  pour Bottom (no thermals): 30.27,57.95 30.27,54.9 25.31,49.95 21,49.95 14.9,43.86 14.9,30.52 18.96,30.52 18.96,33.57 16.55,35.98 16.55,42.46 22.14,48.05 26.08,48.05 31.79,53.76 31.79,57.95
N$11  (via drill 0.3)
  Top 0.254: U$4.3 45.4,40.83 v45.63,41.06 | v51.22,27.85 R9.1
  Bottom 0.254: R23.2 46.27,42.33 45.63,41.7 v45.63,41.06 45.63,36.11 48.43,33.31 48.43,28.87 49.44,27.85 v51.22,27.85
N$12  (via drill 0.3)
  Top 0.2: R10.1 61.25,27.85 61.51,28.11 v61.64,28.11
  Top 0.254: U$5.3 59.63,41.04 v59.6,41.06
  Bottom 0.254: R24.2 60.11,42.46 59.6,41.95 v59.6,41.06 59.6,36.24 62.4,33.44 62.4,28.87 v61.64,28.11
N$13
  pour Top (no thermals): 52.24,38.9 48.05,38.9 48.05,42.08 54.52,48.55 56.68,48.55 56.68,45.63 52.24,41.19
N$14  (via drill 0.35)
  other vias: 44.36,30.9 44.36,33.31 44.36,32.17 44.36,34.46 44.36,35.6 45.25,34.46
  pour Top (no thermals): 46.9,30.52 43.98,30.52 43.98,36.74 45.76,36.74 45.76,34.58 46.9,33.44
  pour Bottom (no thermals): 46.9,30.52 43.47,30.52 43.47,54.14 42.2,55.41 42.2,57.95 43.73,57.95 43.73,56.43 44.62,55.54 44.62,35.73 46.9,33.44
  pour Bottom: 42.2,57.95 42.2,55.41 42.84,54.78 42.84,30.52 46.9,30.52 46.9,33.44 44.62,35.73 44.62,55.54 43.73,56.43 43.73,57.95
N$15
  Top 0.2: R14.1 64.52,28.58 64.81,28.87 D7.A
N$16
  pour Top (no thermals): 17.31,12.49 17.31,7.66 24.04,7.66 24.04,21.38 17.57,21.38 17.57,18.96 20.49,18.96 20.49,12.49
N$17
  pour Top (no thermals): 66.33,38.9 62.27,38.9 62.27,41.95 68.87,48.55 71.03,48.55 71.03,45.89 66.33,41.19
N$18  (via drill 0.35)
  other vias: 58.59,30.9 58.59,33.31 58.59,32.17 58.59,34.46 58.59,35.6 59.48,34.46
  pour Top (no thermals): 61.13,30.52 58.08,30.52 58.08,36.74 59.98,36.74 59.98,34.58 61.13,33.44
  pour Bottom (no thermals): 61.13,30.52 56.94,30.52 56.94,45.63 48.17,54.4 48.17,57.95 49.7,57.95 49.7,56.43 58.59,47.54 58.59,35.98 61.13,33.44
  pour Bottom: 56.94,45.63 48.17,54.4 48.17,57.95 49.7,57.95 49.7,56.43 58.59,47.54 58.59,35.98 61.13,33.44 61.13,30.52 56.94,30.52
N$19
  Top 0.2: RST.1 RST.2 53.16,5.59 52.49,6.26 50.46,6.26 49.51,7.21 U$6.24
N$20
  Top 0.2: U$6.2 60.95,26.41 61.64,27.09 61.93,27.09 R14.2
N$28
  Top 0.2: SBL.4 SBL.3 45.47,25.35 46.65,24.17 50.33,24.17 50.79,24.63 U$6.10
PWM1  (via drill 0.3)
  Top 0.2: U$6.15 46.53,20.1 46.9,19.73 49.57,19.73 v49.95,20.11 | R10.2 v57.19,27.85 57.06,27.85
  Bottom 0.2: J7.6 61.13,6.01 57.95,9.18 53.51,9.18 49.95,12.74 v49.95,20.11 50.33,20.49 50.33,24.1 54.72,28.49 56.68,28.49 57.19,27.98 v57.19,27.85
PWM2  (via drill 0.3)
  Top 0.2: v50.84,18.96 v50.83,18.96 49.83,18.96 49.46,19.33 46.88,19.33 46.39,18.83 U$6.16 | R9.2 v55.67,27.85
  Bottom 0.2: J7.8 58.7,9.58 53.67,9.58 50.35,12.91 50.35,18.47 v50.84,18.96 50.84,24.04 54.65,27.85 v55.67,27.85
PWM3
  Top 0.2: U$6.17 43.74,17.56 37.74,23.55 R7.2
PWM4
  Top 0.2: U$6.18 44.37,16.29 33.19,27.47 R8.2
PWM5  (via drill 0.3)
  Top 0.2: U$6.21 v43.99,12.48 v43.98,12.49 | R6.2 20.11,27.33 v20.11,26.08
  Bottom 0.2: v43.98,12.49 43.98,16.17 32.93,27.22 24.81,27.22 23.66,26.08 v20.11,26.08
TCK  (via drill 0.3)
  Top 0.2: U$6.14 v48.17,21.37 v48.17,21.38
  Bottom 0.2: v48.17,21.38 48.17,20.74 49.55,19.36 49.55,12.57 53.34,8.78 57.34,8.78 58.59,7.53 J7.4
TMS  (via drill 0.3)
  Top 0.2: U$6.13 v47.4,22.64 v47.41,22.65
  Bottom 0.2: v47.41,22.65 47.41,20.94 49.15,19.2 49.15,12.41 53.18,8.38 55.03,8.38 56.05,7.37 J7.2
VCC  (via drill 0.85)  (1 unrouted)
  Top 0.2: 10.2,29.38 F1.1
  other vias: 2.33,12.49
  pour Top (no thermals): 7.28,28.87 7.28,33.82 6.14,34.97 6.14,36.49 15.41,36.49 15.41,30.65 16.3,29.76 21.5,29.76 21.5,33.7 20.11,35.09 20.11,36.49 29.25,36.49 29.25,30.52 30.01,29.76 35.47,29.76 35.47,33.7 33.95,35.22 33.95,36.62 43.35,36.62 43.35,30.65 44.24,29.76 49.44,29.76 49.44,33.95 48.05,35.35 48.05,36.74 57.32,36.74 57.32,30.77 58.33,29.76 63.79,29.76 63.79,33.7 62.27,35.22 62.27,36.74 71.54,36.74 71.54,28.87
  pour Top (no thermals): 11.6,24.93 0.8,24.93 0.8,8.55 15.66,8.55 15.66,10.71 4.74,10.71 4.74,22.27 11.6,22.27
  pour Top (no thermals): 11.6,26.33 8.8,26.33 8.8,29.12 11.6,29.12

### Text on the board
tNames: t.me/deaxx | + | + | + | + | + | STATUS | + | JLCJLCJLCJLC | - | +
bNames: 2. TMS | 4. TCK | 6. TDO | 8. TDI | 1. 3V3 | 3. GND | 5. TX | 7. RX